# Altium schematic sheet S7CAS-PLEIADES-CARTE-MERE_P20_DAC.SchDoc
size Tabloid; SheetNumber: 15; SheetTotal: 20; Sheet_Name: DAC; Size: 11x17
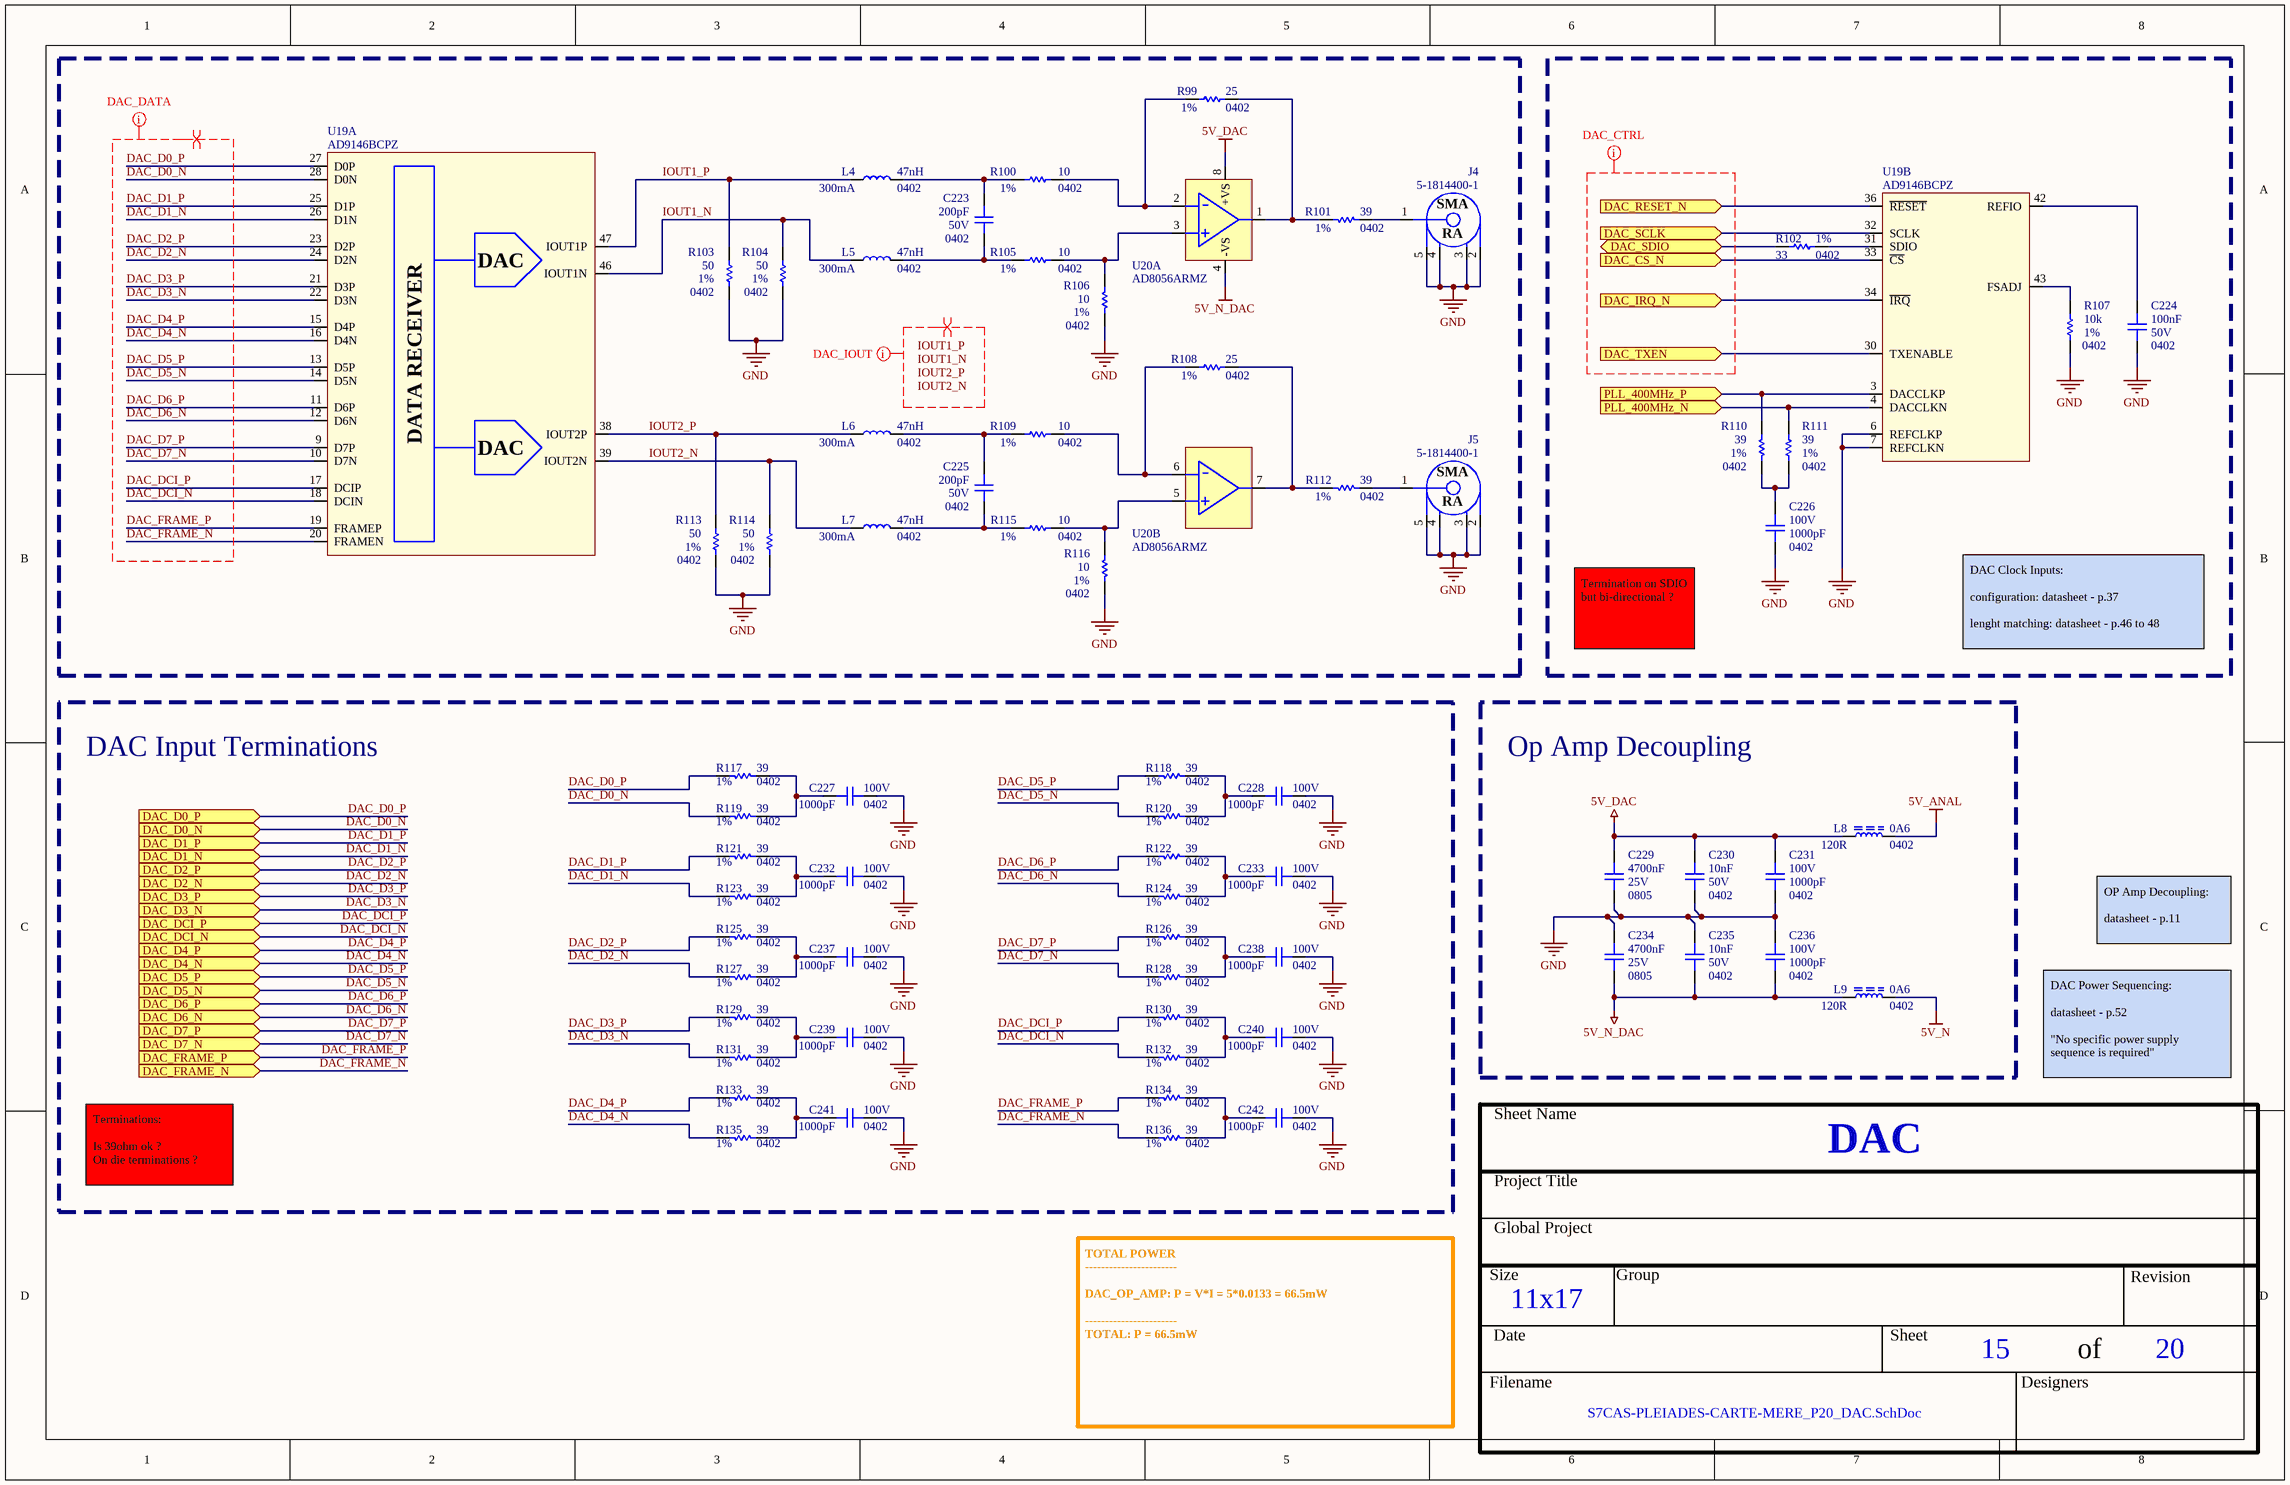
[diagram p0: S7CAS-PLEIADES-CARTE-MERE_P20_DAC.SchDoc]

## Parts
C223  value 200pF  Voltage: 50V  Package: 0402  [CAP_0402]  (hidden comment: CAP - 0402)
C224  value 100nF  Voltage: 50V  Package: 0402  [CAP_0402]  (hidden comment: CAP - 0402)
C225  value 200pF  Voltage: 50V  Package: 0402  [CAP_0402]  (hidden comment: CAP - 0402)
C226  value 1000pF  Voltage: 100V  Package: 0402  [CAP_0402]  (hidden comment: CAP - 0402)
C227  value 1000pF  Voltage: 100V  Package: 0402  [CAP_0402]  (hidden comment: CAP - 0402)
C228  value 1000pF  Voltage: 100V  Package: 0402  [CAP_0402]  (hidden comment: CAP - 0402)
C229  value 4700nF  Voltage: 25V  Package: 0805  [CAP_0805]  (hidden comment: CAP - 0805)
C230  value 10nF  Voltage: 50V  Package: 0402  [CAP_0402]  (hidden comment: CAP - 0402)
C231  value 1000pF  Voltage: 100V  Package: 0402  [CAP_0402]  (hidden comment: CAP - 0402)
C232  value 1000pF  Voltage: 100V  Package: 0402  [CAP_0402]  (hidden comment: CAP - 0402)
C233  value 1000pF  Voltage: 100V  Package: 0402  [CAP_0402]  (hidden comment: CAP - 0402)
C234  value 4700nF  Voltage: 25V  Package: 0805  [CAP_0805]  (hidden comment: CAP - 0805)
C235  value 10nF  Voltage: 50V  Package: 0402  [CAP_0402]  (hidden comment: CAP - 0402)
C236  value 1000pF  Voltage: 100V  Package: 0402  [CAP_0402]  (hidden comment: CAP - 0402)
C237  value 1000pF  Voltage: 100V  Package: 0402  [CAP_0402]  (hidden comment: CAP - 0402)
C238  value 1000pF  Voltage: 100V  Package: 0402  [CAP_0402]  (hidden comment: CAP - 0402)
C239  value 1000pF  Voltage: 100V  Package: 0402  [CAP_0402]  (hidden comment: CAP - 0402)
C240  value 1000pF  Voltage: 100V  Package: 0402  [CAP_0402]  (hidden comment: CAP - 0402)
C241  value 1000pF  Voltage: 100V  Package: 0402  [CAP_0402]  (hidden comment: CAP - 0402)
C242  value 1000pF  Voltage: 100V  Package: 0402  [CAP_0402]  (hidden comment: CAP - 0402)
J4  5-1814400-1  [CONN_SMA_5-1814400-1]
J5  5-1814400-1  [CONN_SMA_5-1814400-1]
L4  value 47nH  Current: 300mA  Package: 0402  [IND_0402]  (hidden comment: Part Number)
L5  value 47nH  Current: 300mA  Package: 0402  [IND_0402]  (hidden comment: Part Number)
L6  value 47nH  Current: 300mA  Package: 0402  [IND_0402]  (hidden comment: Part Number)
L7  value 47nH  Current: 300mA  Package: 0402  [IND_0402]  (hidden comment: Part Number)
L8  value 120R  Current: 0A6  Package: 0402  [FER_0402]  (hidden comment: FER - 0402)
L9  value 120R  Current: 0A6  Package: 0402  [FER_0402]  (hidden comment: FER - 0402)
R99  value 25  Package: 0402  Precision: 1%  [RES_0402]  (hidden comment: RES - 0402)
R100  value 10  Package: 0402  Precision: 1%  [RES_0402]  (hidden comment: RES - 0402)
R101  value 39  Package: 0402  Precision: 1%  [RES_0402]  (hidden comment: RES - 0402)
R102  value 33  Package: 0402  Precision: 1%  [RES_0402]  (hidden comment: RES - 0402)
R103  value 50  Package: 0402  Precision: 1%  [RES_0402]  (hidden comment: RES - 0402)
R104  value 50  Package: 0402  Precision: 1%  [RES_0402]  (hidden comment: RES - 0402)
R105  value 10  Package: 0402  Precision: 1%  [RES_0402]  (hidden comment: RES - 0402)
R106  value 10  Package: 0402  Precision: 1%  [RES_0402]  (hidden comment: RES - 0402)
R107  value 10k  Package: 0402  Precision: 1%  [RES_0402]  (hidden comment: RES - 0402)
R108  value 25  Package: 0402  Precision: 1%  [RES_0402]  (hidden comment: RES - 0402)
R109  value 10  Package: 0402  Precision: 1%  [RES_0402]  (hidden comment: RES - 0402)
R110  value 39  Package: 0402  Precision: 1%  [RES_0402]  (hidden comment: RES - 0402)
R111  value 39  Package: 0402  Precision: 1%  [RES_0402]  (hidden comment: RES - 0402)
R112  value 39  Package: 0402  Precision: 1%  [RES_0402]  (hidden comment: RES - 0402)
R113  value 50  Package: 0402  Precision: 1%  [RES_0402]  (hidden comment: RES - 0402)
R114  value 50  Package: 0402  Precision: 1%  [RES_0402]  (hidden comment: RES - 0402)
R115  value 10  Package: 0402  Precision: 1%  [RES_0402]  (hidden comment: RES - 0402)
R116  value 10  Package: 0402  Precision: 1%  [RES_0402]  (hidden comment: RES - 0402)
R117  value 39  Package: 0402  Precision: 1%  [RES_0402]  (hidden comment: RES - 0402)
R118  value 39  Package: 0402  Precision: 1%  [RES_0402]  (hidden comment: RES - 0402)
R119  value 39  Package: 0402  Precision: 1%  [RES_0402]  (hidden comment: RES - 0402)
R120  value 39  Package: 0402  Precision: 1%  [RES_0402]  (hidden comment: RES - 0402)
R121  value 39  Package: 0402  Precision: 1%  [RES_0402]  (hidden comment: RES - 0402)
R122  value 39  Package: 0402  Precision: 1%  [RES_0402]  (hidden comment: RES - 0402)
R123  value 39  Package: 0402  Precision: 1%  [RES_0402]  (hidden comment: RES - 0402)
R124  value 39  Package: 0402  Precision: 1%  [RES_0402]  (hidden comment: RES - 0402)
R125  value 39  Package: 0402  Precision: 1%  [RES_0402]  (hidden comment: RES - 0402)
R126  value 39  Package: 0402  Precision: 1%  [RES_0402]  (hidden comment: RES - 0402)
R127  value 39  Package: 0402  Precision: 1%  [RES_0402]  (hidden comment: RES - 0402)
R128  value 39  Package: 0402  Precision: 1%  [RES_0402]  (hidden comment: RES - 0402)
R129  value 39  Package: 0402  Precision: 1%  [RES_0402]  (hidden comment: RES - 0402)
R130  value 39  Package: 0402  Precision: 1%  [RES_0402]  (hidden comment: RES - 0402)
R131  value 39  Package: 0402  Precision: 1%  [RES_0402]  (hidden comment: RES - 0402)
R132  value 39  Package: 0402  Precision: 1%  [RES_0402]  (hidden comment: RES - 0402)
R133  value 39  Package: 0402  Precision: 1%  [RES_0402]  (hidden comment: RES - 0402)
R134  value 39  Package: 0402  Precision: 1%  [RES_0402]  (hidden comment: RES - 0402)
R135  value 39  Package: 0402  Precision: 1%  [RES_0402]  (hidden comment: RES - 0402)
R136  value 39  Package: 0402  Precision: 1%  [RES_0402]  (hidden comment: RES - 0402)
U19  AD9146BCPZ  [DAC_AD9146BCPZ]  (parts A,B of 3)
U20  AD8056ARMZ  [OPAMP_AD8056ARMZ]  (parts A,B of 2)

## Blocks framed on the sheet
DAC Input Terminations: C227 C228 C232 C233 C237-C242 R117-R136
Op Amp Decoupling: C229-C231 C234-C236 L8 L9

## Ports
DAC_CS_N (in), DAC_D0_N (in), DAC_D0_P (in), DAC_D1_N (in), DAC_D1_P (in), DAC_D2_N (in), DAC_D2_P (in), DAC_D3_N (in), DAC_D3_P (in), DAC_D4_N (in), DAC_D4_P (in), DAC_D5_N (in), DAC_D5_P (in), DAC_D6_N (in), DAC_D6_P (in), DAC_D7_N (in), DAC_D7_P (in), DAC_DCI_N (in), DAC_DCI_P (in), DAC_FRAME_N (in), DAC_FRAME_P (in), DAC_IRQ_N (in), DAC_RESET_N (in), DAC_SCLK (in), DAC_SDIO (bidir), DAC_TXEN (in), PLL_400MHz_N (in), PLL_400MHz_P (in)

## Nets
5V_ANAL: L8.1
5V_DAC: C229.2 C230.2 C231.1 L8.2 U20.8(+VS)
5V_N: L9.1
5V_N_DAC: C234.1 C235.1 C236.2 L9.2 U20.4(-VS)
GND: C224.1 C226.2 C227.1 C228.1 C229.1 C230.1 C231.2 C232.1 C233.1 C234.2 C235.2 C236.1 C237.1 C238.1 C239.1 C240.1 C241.1 C242.1 J4.2 J4.3 J4.4 J4.5 J5.2 J5.3 J5.4 J5.5 R103.2 R104.2 R106.1 R107.1 R113.2 R114.2 R116.1 U19.6(REFCLKP) U19.7(REFCLKN)
DAC_CS_N: U19.33(~{CS}) ; port DAC_CS_N
DAC_D0_N: R119.1 U19.28(D0N) ; port DAC_D0_N
DAC_D0_P: R117.1 U19.27(D0P) ; port DAC_D0_P
DAC_D1_N: R123.1 U19.26(D1N) ; port DAC_D1_N
DAC_D1_P: R121.1 U19.25(D1P) ; port DAC_D1_P
DAC_D2_N: R127.1 U19.24(D2N) ; port DAC_D2_N
DAC_D2_P: R125.1 U19.23(D2P) ; port DAC_D2_P
DAC_D3_N: R131.1 U19.22(D3N) ; port DAC_D3_N
DAC_D3_P: R129.1 U19.21(D3P) ; port DAC_D3_P
DAC_D4_N: R135.1 U19.16(D4N) ; port DAC_D4_N
DAC_D4_P: R133.1 U19.15(D4P) ; port DAC_D4_P
DAC_D5_N: R120.1 U19.14(D5N) ; port DAC_D5_N
DAC_D5_P: R118.1 U19.13(D5P) ; port DAC_D5_P
DAC_D6_N: R124.1 U19.12(D6N) ; port DAC_D6_N
DAC_D6_P: R122.1 U19.11(D6P) ; port DAC_D6_P
DAC_D7_N: R128.1 U19.10(D7N) ; port DAC_D7_N
DAC_D7_P: R126.1 U19.9(D7P) ; port DAC_D7_P
DAC_DCI_N: R132.1 U19.18(DCIN) ; port DAC_DCI_N
DAC_DCI_P: R130.1 U19.17(DCIP) ; port DAC_DCI_P
DAC_FRAME_N: R136.1 U19.20(FRAMEN) ; port DAC_FRAME_N
DAC_FRAME_P: R134.1 U19.19(FRAMEP) ; port DAC_FRAME_P
DAC_IRQ_N: U19.34(~{IRQ}) ; port DAC_IRQ_N
DAC_RESET_N: U19.36(~{RESET}) ; port DAC_RESET_N
DAC_SCLK: U19.32(SCLK) ; port DAC_SCLK
DAC_SDIO: R102.2 ; port DAC_SDIO
DAC_TXEN: U19.30(TXENABLE) ; port DAC_TXEN
IOUT1_N: L5.1 R104.1 U19.46(IOUT1N)
IOUT1_P: L4.1 R103.1 U19.47(IOUT1P)
IOUT2_N: L7.1 R114.1 U19.39(IOUT2N)
IOUT2_P: L6.1 R113.1 U19.38(IOUT2P)
PLL_400MHz_N: R111.2 U19.4(DACCLKN) ; port PLL_400MHz_N
PLL_400MHz_P: R110.2 U19.3(DACCLKP) ; port PLL_400MHz_P
NetC223_1: C223.1 L5.2 R105.2
NetC223_2: C223.2 L4.2 R100.2
NetC224_2: C224.2 U19.42(REFIO)
NetC225_1: C225.1 L7.2 R115.2
NetC225_2: C225.2 L6.2 R109.2
NetC226_1: C226.1 R110.1 R111.1
NetC227_2: C227.2 R117.2 R119.2
NetC228_2: C228.2 R118.2 R120.2
NetC232_2: C232.2 R121.2 R123.2
NetC233_2: C233.2 R122.2 R124.2
NetC237_2: C237.2 R125.2 R127.2
NetC238_2: C238.2 R126.2 R128.2
NetC239_2: C239.2 R129.2 R131.2
NetC240_2: C240.2 R130.2 R132.2
NetC241_2: C241.2 R133.2 R135.2
NetC242_2: C242.2 R134.2 R136.2
NetJ4_1: J4.1 R101.2
NetJ5_1: J5.1 R112.2
NetR99_1: R99.1 R101.1 U20.1(OUT1)
NetR99_2: R99.2 R100.1 U20.2(-IN1)
NetR102_1: R102.1 U19.31(SDIO)
NetR105_1: R105.1 R106.2 U20.3(+IN1)
NetR107_2: R107.2 U19.43(FSADJ)
NetR108_1: R108.1 R112.1 U20.7(OUT2)
NetR108_2: R108.2 R109.1 U20.6(-IN2)
NetR115_1: R115.1 R116.2 U20.5(+IN2)

## Layout directives
net class TRACKS_50: (no net found under the mark), DAC_D0_N, DAC_D0_P, DAC_D1_N, DAC_D1_P, DAC_D2_N, DAC_D2_P, DAC_D3_N, DAC_D3_P, DAC_D4_N, DAC_D4_P, DAC_D5_N, DAC_D5_P, DAC_D6_N, DAC_D6_P, DAC_D7_N, DAC_D7_P, DAC_DCI_N, DAC_DCI_P, DAC_FRAME_N, DAC_FRAME_P, IOUT1_N, IOUT1_P, IOUT2_N, IOUT2_P
differential pair: DAC_D0_N, DAC_D0_P, DAC_D1_N, DAC_D1_P, DAC_D2_N, DAC_D2_P, DAC_D3_N, DAC_D3_P, DAC_D4_N, DAC_D4_P, DAC_D5_N, DAC_D5_P, DAC_D6_N, DAC_D6_P, DAC_D7_N, DAC_D7_P, DAC_DCI_N, DAC_DCI_P, DAC_FRAME_N, DAC_FRAME_P, IOUT1_N, IOUT1_P, IOUT2_N, IOUT2_P

## Notes on the sheet
- Termination on SDIO but bi-directional ?
- DAC Clock Inputs:
  configuration: datasheet - p.37
  lenght matching: datasheet - p.46 to 48
- OP Amp Decoupling:
  datasheet - p.11
- DAC Power Sequencing:
  datasheet - p.52
  "No specific power supply sequence is required"
- Terminations:
  Is 39ohm ok ?
  On die terminations ?
- TOTAL POWER
  -----------------------
  DAC_OP_AMP: P = V*I = 5*0.0133 = 66.5mW
  -----------------------
  TOTAL: P = 66.5mW
- Labels drawn without touching a wire or pin: IOUT1_N, IOUT1_P, IOUT2_N, IOUT2_P
- Sheet Name
- Project Title
- Global Project
- Size
- Group
- Revision
- Date
- Sheet
- of
- Filename
- Designers
- (in symbol CONN_SMA_5-1814400-1) SMA; RA
- (in symbol DAC_AD9146BCPZ, part A) DAC; DATA RECEIVER

## Library data of the parts
C223 C225 = CAP - 0402: Mfg Part Number: GCM1555G1H201GA16; Precision: 10%; Current: *; CreatedBy: Jonathan Bouchard; Power: *
C224 = CAP - 0402: Mfg Part Number: GRM155R61H104KE14; Precision: 10%; Current: *; CreatedBy: Jonathan Bouchard; Power: *
C226-C228 C231-C233 C236-C242 = CAP - 0402: Mfg Part Number: GRM155R72A102KA01; Precision: 10%; Current: *; CreatedBy: Jonathan Bouchard; Power: *
C229 C234 = CAP - 0805: Mfg Part Number: GRM219R61E475KA73; Precision: 10%; Current: *; CreatedBy: Jonathan Bouchard; Power: *
C230 C235 = CAP - 0402: Mfg Part Number: GCM155R71H103KA55; Precision: 10%; Current: *; CreatedBy: Jonathan Bouchard; Power: *
J4 J5 = CONN_SMA_5-1814400-1: CONN -  SMA JACK R/A 50 OHM - TH; Mfg: TE Connectivity AMP Connectors; Voltage: *; Current: *; Power: *; Mfg Part Number: 5-1814400-1; HelpURL: http://www.te.com/commerce/DocumentDelivery/DDEController?Action=srchrtrv&DocNm=1814400&DocType=Customer+Drawing&DocLang=English; CreatedBy: Jonathan Bouchard; Temperature: -55°C ~ 85°C; Value: *; Precision: *; Package: TH-5; Supplier 1: Digikey; Supplier Part Number 1: A97593-ND
L4-L7 = IND - 0402: Mfg Part Number: TBD; Voltage: *
L8 L9 = FER - 0402: Mfg Part Number: BLM15BX121SN1; Voltage: *; CreatedBy: Jonathan Bouchard; Power: *; Precision: *
R99 R108 = RES - 0402: Mfg Part Number: CH0402-25RJFT; Voltage: 50V; Power: 1/16W; Current: *; CreatedBy: Jonathan Bouchard
R100 R105 R106 R109 R115 R116 = RES - 0402: Mfg Part Number: RN73H1ETTP10R1F50; Voltage: 50V; Power: 1/16W; Current: *; CreatedBy: Jonathan Bouchard
R101 R110-R112 R117-R136 = RES - 0402: Mfg Part Number: RL0510S-390-F; Voltage: 50; Power: 1/16W; Current: *; CreatedBy: Jonathan Bouchard
R102 = RES - 0402: Mfg Part Number: CRCW040233R0FKEDC; Voltage: 50V; Power: 1/16W; Current: *; CreatedBy: Jonathan Bouchard
R103 R104 R113 R114 = RES - 0402: Mfg Part Number: MIC5000BFLMGNHWS; Power: 1/8W; Voltage: 50; Current: *; CreatedBy: Jonathan Bouchard
R107 = RES - 0402: Mfg Part Number: MCS04020C1002FE000; Voltage: 50V; Power: 1/16W; Current: *; CreatedBy: Jonathan Bouchard
U19 = DAC_AD9146BCPZ: DAC - 16BIT SRL HIGH SPEED - QFN-48; Voltage: 3.13 V ~ 3.47 V / 1.71 V ~ 1.89 V; Mfg: Analog Devices Inc.; Current: *; Power: *; Mfg Part Number: AD9146BCPZ; HelpURL: http://www.analog.com/media/en/technical-documentation/data-sheets/AD9146.PDF; CreatedBy: Jonathan Bouchard; Temperature: -40°C ~ 85°C; Value: *; Precision: 16 Bit; Package: QFN-48; Supplier 1: Digikey; Supplier Part Number 1: AD9146BCPZ-ND
U20 = OPAMP_AD8056ARMZ: OPAMP - VFB 300MHZ - 8MSOP; Voltage: 8 V ~ 12 V, ±4 V ~ 6 V; Current: 60mA; Mfg: Analog Devices; Power: *; Mfg Part Number: AD8056ARMZ; HelpURL: http://www.analog.com/media/en/technical-documentation/data-sheets/AD8055_8056.pdf; CreatedBy: Jonathan Bouchard; Temperature: -40°C ~ 125°C; Value: *; Precision: *; Package: MSOP-8; Supplier 1: Digikey; Supplier Part Number 1: AD8056ARMZ-REEL7CT-ND